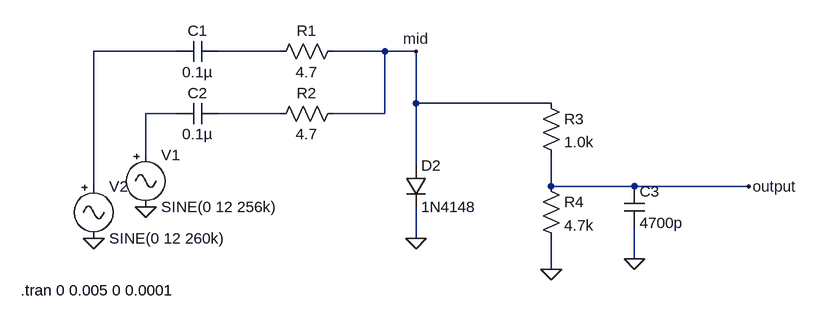
[diagram p0: schematic Draft3.asc]
Draft3.asc, the LTspice schematic file:
Version 4
SHEET 1 1024 680
WIRE -336 -64 -464 -64
WIRE -176 -64 -272 -64
WIRE -16 -64 -96 -64
WIRE 32 -64 -16 -64
WIRE 32 16 32 -64
WIRE 240 16 32 16
WIRE -336 32 -384 32
WIRE -176 32 -272 32
WIRE -16 32 -16 -64
WIRE -16 32 -96 32
WIRE -384 96 -384 32
WIRE 32 112 32 16
WIRE -464 144 -464 -64
WIRE 240 144 240 96
WIRE 368 144 240 144
WIRE 544 144 368 144
WIRE 32 224 32 176
WIRE 368 256 368 208
WIRE 240 272 240 224
FLAG -384 176 0
FLAG -464 224 0
FLAG 32 -64 mid
FLAG 32 224 0
FLAG 240 272 0
FLAG 368 256 0
FLAG 544 144 output
SYMBOL res -80 -80 R90
WINDOW 0 0 56 VBottom 2
WINDOW 3 32 56 VTop 2
SYMATTR InstName R1
SYMATTR Value 4.7
SYMBOL res -80 16 R90
WINDOW 0 0 56 VBottom 2
WINDOW 3 32 56 VTop 2
SYMATTR InstName R2
SYMATTR Value 4.7
SYMBOL cap -272 -80 R90
WINDOW 0 0 32 VBottom 2
WINDOW 3 32 32 VTop 2
SYMATTR InstName C1
SYMATTR Value 0.1µ
SYMBOL cap -272 16 R90
WINDOW 0 0 32 VBottom 2
WINDOW 3 32 32 VTop 2
SYMATTR InstName C2
SYMATTR Value 0.1µ
SYMBOL Misc\\signal -384 80 R0
WINDOW 123 0 0 Left 0
WINDOW 39 0 0 Left 0
SYMATTR InstName V1
SYMATTR Value SINE(0 12 256k)
SYMBOL Misc\\signal -464 128 R0
WINDOW 123 0 0 Left 0
WINDOW 39 0 0 Left 0
SYMATTR InstName V2
SYMATTR Value SINE(0 12 260k)
SYMBOL diode 16 112 R0
SYMATTR InstName D2
SYMATTR Value 1N4148
SYMBOL res 224 0 R0
SYMATTR InstName R3
SYMATTR Value 1.0k
SYMBOL res 224 128 R0
SYMATTR InstName R4
SYMATTR Value 4.7k
SYMBOL cap 352 144 R0
SYMATTR InstName C3
SYMATTR Value 4700p
TEXT -576 304 Left 2 !.tran 0 0.005 0 0.0001

The netlist it stands for:
* Draft3.asc
R1 mid N002 4.7
R2 mid N004 4.7
C1 N002 N001 0.1µ
C2 N004 N003 0.1µ
V1 N003 0 SINE(0 12 256k)
V2 N001 0 SINE(0 12 260k)
D2 mid 0 1N4148
R3 mid output 1.0k
R4 output 0 4.7k
C3 output 0 4700p
.model D D
.lib standard.dio
.tran 0 0.005 0 0.0001
.backanno
.end